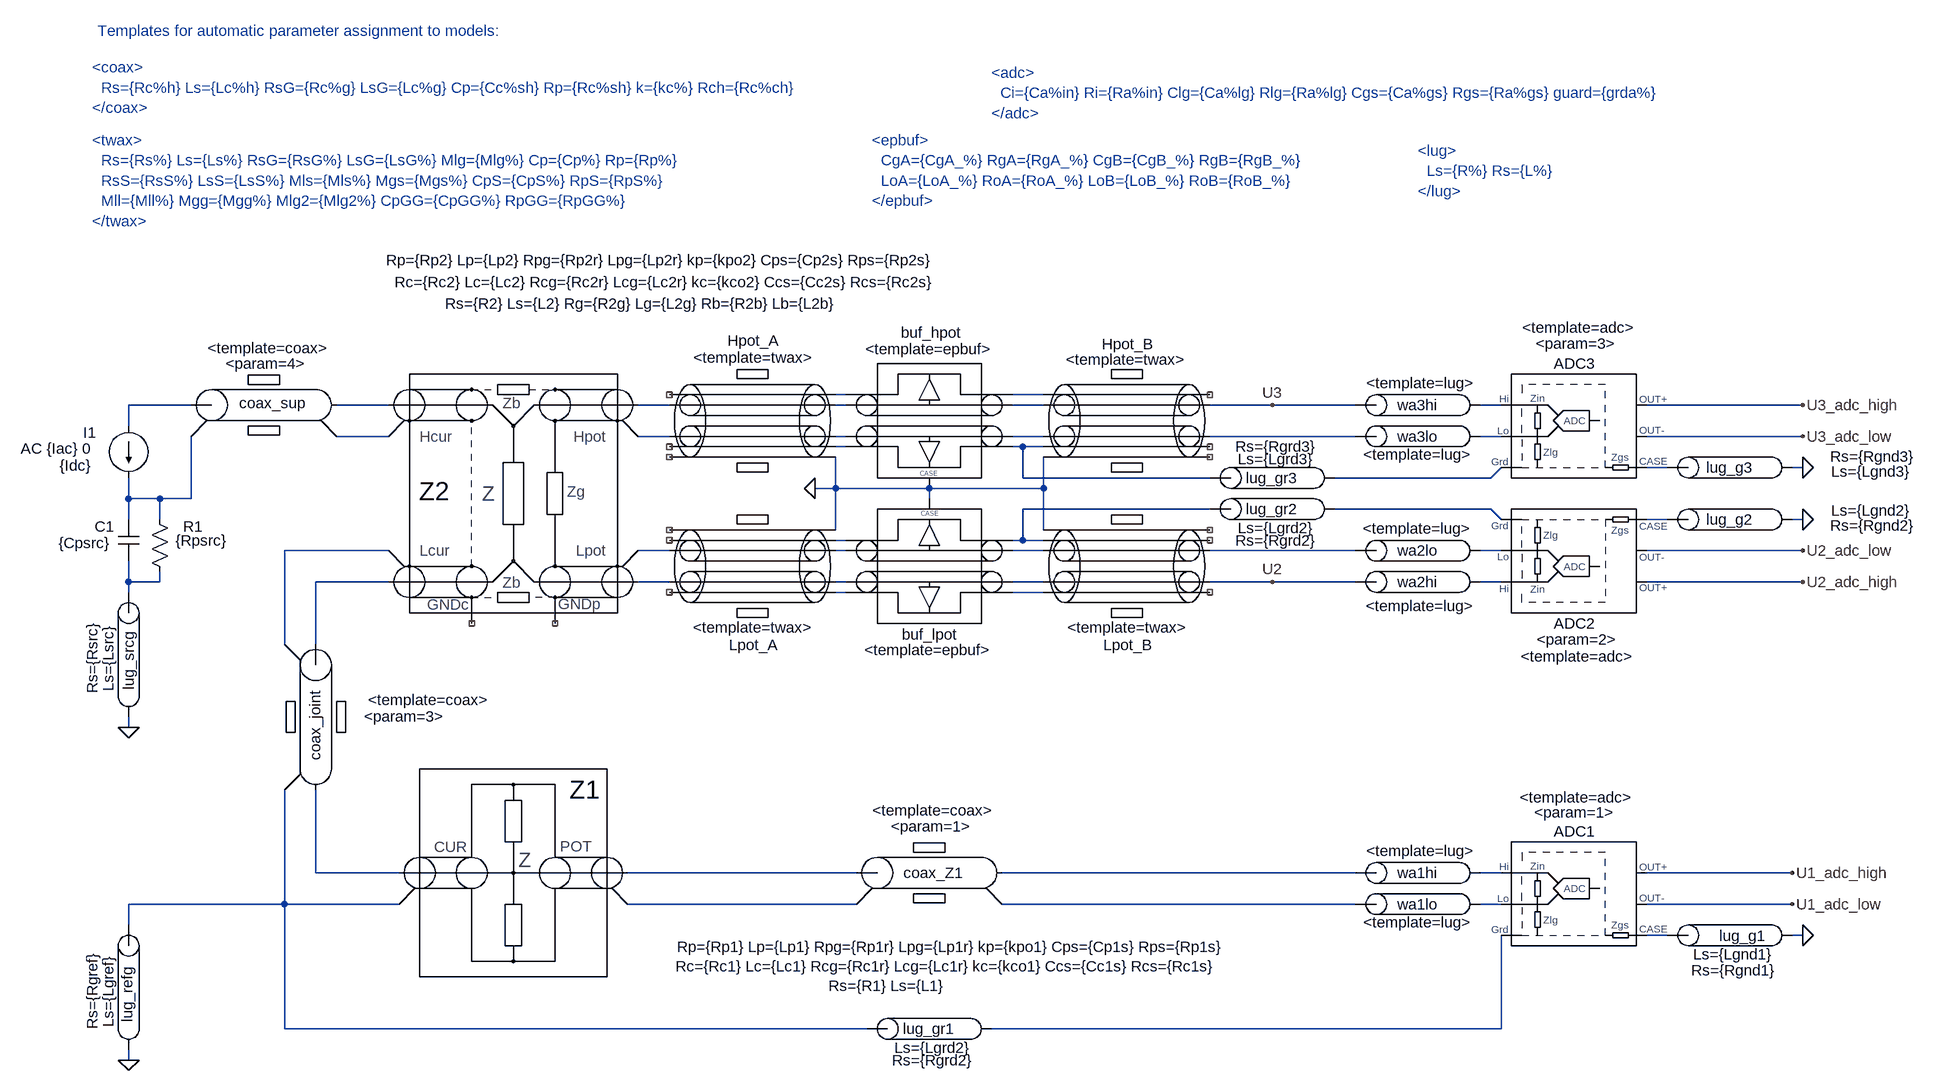
[diagram p0: schematic LiB_brg_4TP_twax.asc]
LiB_brg_4TP_twax.asc, the LTspice schematic file:
Version 4
SHEET 1 4400 2632
WIRE 208 -1872 192 -1872
WIRE 512 -1872 464 -1872
WIRE -800 -1856 -896 -1856
WIRE -496 -1856 -576 -1856
WIRE -64 -1856 -112 -1856
WIRE 208 -1856 192 -1856
WIRE 512 -1856 464 -1856
WIRE 864 -1856 768 -1856
WIRE 992 -1856 864 -1856
WIRE 1216 -1856 1184 -1856
WIRE 1680 -1856 1440 -1856
WIRE -896 -1824 -896 -1856
WIRE -496 -1808 -576 -1808
WIRE -64 -1808 -112 -1808
WIRE 208 -1808 192 -1808
WIRE 512 -1808 464 -1808
WIRE 992 -1808 768 -1808
WIRE 1216 -1808 1184 -1808
WIRE 1680 -1808 1440 -1808
WIRE 208 -1792 192 -1792
WIRE 480 -1792 464 -1792
WIRE 512 -1792 480 -1792
WIRE 1472 -1760 1440 -1760
WIRE 1680 -1760 1664 -1760
WIRE 480 -1744 480 -1792
WIRE 768 -1744 480 -1744
WIRE 1200 -1744 1216 -1760
WIRE 1200 -1744 960 -1744
WIRE 192 -1728 192 -1776
WIRE 192 -1728 160 -1728
WIRE 336 -1728 192 -1728
WIRE 512 -1728 512 -1776
WIRE 512 -1728 336 -1728
WIRE -896 -1712 -896 -1744
WIRE -848 -1712 -896 -1712
WIRE -800 -1712 -800 -1808
WIRE -800 -1712 -848 -1712
WIRE 336 -1712 336 -1728
WIRE 768 -1696 480 -1696
WIRE 1200 -1696 960 -1696
WIRE -896 -1680 -896 -1712
WIRE -848 -1680 -848 -1712
WIRE 1216 -1680 1200 -1696
WIRE 1472 -1680 1440 -1680
WIRE 1680 -1680 1664 -1680
WIRE 192 -1664 192 -1728
WIRE 512 -1664 512 -1728
WIRE 208 -1648 192 -1648
WIRE 480 -1648 480 -1696
WIRE 480 -1648 464 -1648
WIRE 512 -1648 480 -1648
WIRE -496 -1632 -656 -1632
WIRE -64 -1632 -112 -1632
WIRE 208 -1632 192 -1632
WIRE 512 -1632 464 -1632
WIRE 992 -1632 768 -1632
WIRE 1216 -1632 1184 -1632
WIRE 1680 -1632 1440 -1632
WIRE -896 -1584 -896 -1616
WIRE -848 -1584 -848 -1600
WIRE -848 -1584 -896 -1584
WIRE -496 -1584 -608 -1584
WIRE -64 -1584 -112 -1584
WIRE 208 -1584 192 -1584
WIRE 512 -1584 464 -1584
WIRE 864 -1584 768 -1584
WIRE 992 -1584 864 -1584
WIRE 1216 -1584 1184 -1584
WIRE 1680 -1584 1440 -1584
WIRE -896 -1568 -896 -1584
WIRE 208 -1568 192 -1568
WIRE 512 -1568 464 -1568
WIRE -656 -1488 -656 -1632
WIRE -608 -1488 -608 -1584
WIRE -896 -1360 -896 -1376
WIRE -608 -1136 -608 -1264
WIRE -480 -1136 -608 -1136
WIRE 224 -1136 -128 -1136
WIRE 992 -1136 448 -1136
WIRE 1216 -1136 1184 -1136
WIRE 1664 -1136 1440 -1136
WIRE -656 -1088 -656 -1264
WIRE -656 -1088 -896 -1088
WIRE -480 -1088 -656 -1088
WIRE 224 -1088 -128 -1088
WIRE 992 -1088 448 -1088
WIRE 1216 -1088 1184 -1088
WIRE 1664 -1088 1440 -1088
WIRE -896 -1056 -896 -1088
WIRE 1472 -1040 1440 -1040
WIRE 1680 -1040 1664 -1040
WIRE -656 -896 -656 -1088
WIRE 240 -896 -656 -896
WIRE 1216 -896 1216 -1040
WIRE 1216 -896 432 -896
WIRE -896 -848 -896 -864
FLAG 1680 -1040 0
FLAG -896 -1360 0
FLAG 1664 -1088 U1_adc_low
FLAG 1664 -1136 U1_adc_high
FLAG 1680 -1632 U2_adc_low
FLAG 1680 -1760 0
FLAG 1680 -1856 U3_adc_high
FLAG 1680 -1584 U2_adc_high
FLAG 1680 -1680 0
FLAG 160 -1728 0
FLAG 1680 -1808 U3_adc_low
FLAG 864 -1584 U2
FLAG 864 -1856 U3
FLAG -896 -848 0
SYMBOL std_coax_2P -400 -1088 R0
WINDOW 0 206 -176 Center 4
WINDOW 3 778 66 Center 2
WINDOW 123 765 96 Center 2
WINDOW 39 671 126 Center 2
SYMATTR InstName Z1
SYMATTR Value Rp={Rp1} Lp={Lp1} Rpg={Rp1r} Lpg={Lp1r} kp={kpo1} Cps={Cp1s} Rps={Rp1s}
SYMATTR Value2 Rc={Rc1} Lc={Lc1} Rcg={Rc1r} Lcg={Lc1r} kc={kco1} Ccs={Cc1s} Rcs={Rc1s}
SYMATTR SpiceLine Rs={R1} Ls={L1}
SYMBOL coax_cable -608 -1376 R90
WINDOW 0 13 1 Center 2
WINDOW 3 -26 -174 VCenter 2
WINDOW 123 -1 -137 VCenter 2
WINDOW 39 9 -199 Invisible 2
WINDOW 40 -19 -213 Invisible 2
SYMATTR InstName coax_joint
SYMATTR Value <template=coax>
SYMATTR Value2 <param=3>
SYMATTR SpiceLine ""
SYMATTR SpiceLine2 ""
SYMBOL coax_cable -688 -1856 R0
WINDOW 0 14 -3 Center 2
WINDOW 3 7 -88 Center 2
WINDOW 123 4 -64 Center 2
WINDOW 39 3 -65 Invisible 2
WINDOW 40 3 -92 Invisible 2
SYMATTR InstName coax_sup
SYMATTR Value <template=coax>
SYMATTR Value2 <param=4>
SYMATTR SpiceLine ""
SYMATTR SpiceLine2 ""
SYMBOL current -896 -1824 R0
WINDOW 0 -70 10 Left 2
WINDOW 3 -106 61 Left 2
WINDOW 123 -166 35 Left 2
SYMATTR InstName I1
SYMATTR Value {Idc}
SYMATTR Value2 AC {Iac} 0
SYMBOL coax_cable 336 -1136 R0
WINDOW 0 7 0 Center 2
WINDOW 3 6 -96 Center 2
WINDOW 123 4 -72 Center 2
WINDOW 39 3 -65 Invisible 2
WINDOW 40 3 -92 Invisible 2
SYMATTR InstName coax_Z1
SYMATTR Value <template=coax>
SYMATTR Value2 <param=1>
SYMATTR SpiceLine ""
SYMATTR SpiceLine2 ""
SYMBOL ground_lug 864 -1744 M180
SYMATTR InstName lug_gr3
SYMATTR Value Rs={Rgrd3}
SYMATTR Value2 Ls={Lgrd3}
SYMBOL ground_lug 1568 -1040 R0
WINDOW 0 -16 1 Left 2
WINDOW 3 6 54 Center 2
SYMATTR InstName lug_g1
SYMATTR Value Rs={Rgnd1}
SYMATTR Value2 Ls={Lgnd1}
SYMBOL ground_lug -896 -1472 R90
WINDOW 3 5 56 Center 2
WINDOW 123 6 31 Center 2
WINDOW 0 9 0 Center 2
SYMATTR Value Rs={Rsrc}
SYMATTR Value2 Ls={Lsrc}
SYMATTR InstName lug_srcg
SYMBOL std_4TP2 -208 -1808 M0
WINDOW 0 217 85 Center 4
WINDOW 3 -138 -271 Center 2
WINDOW 123 -141 -237 Center 2
WINDOW 39 -107 -204 Center 2
SYMATTR InstName Z2
SYMATTR Value Rp={Rp2} Lp={Lp2} Rpg={Rp2r} Lpg={Lp2r} kp={kpo2} Cps={Cp2s} Rps={Rp2s}
SYMATTR Value2 Rc={Rc2} Lc={Lc2} Rcg={Rc2r} Lcg={Lc2r} kc={kco2} Ccs={Cc2s} Rcs={Rc2s}
SYMATTR SpiceLine Rs={R2} Ls={L2} Rg={R2g} Lg={L2g} Rb={R2b} Lb={L2b}
SYMBOL ground_lug 1568 -1760 M180
WINDOW 3 220 17 Center 2
WINDOW 123 218 -6 Center 2
SYMATTR Value Rs={Rgnd3}
SYMATTR Value2 Ls={Lgnd3}
SYMATTR InstName lug_g3
SYMBOL ground_lug 864 -1696 R0
SYMATTR InstName lug_gr2
SYMATTR Value Rs={Rgrd2}
SYMATTR Value2 Ls={Lgrd2}
SYMBOL ground_lug 1568 -1680 R0
WINDOW 3 220 9 Center 2
WINDOW 123 218 -14 Center 2
SYMATTR Value Rs={Rgnd2}
SYMATTR Value2 Ls={Lgnd2}
SYMATTR InstName lug_g2
SYMBOL twax_cable 64 -1856 R180
WINDOW 0 -2 99 Center 2
WINDOW 3 -2 73 Center 2
WINDOW 123 2 91 Invisible 2
WINDOW 39 0 114 Invisible 2
SYMATTR InstName Hpot_A
SYMATTR Value <template=twax>
SYMATTR Value2 ""
SYMATTR SpiceLine ""
SYMBOL twax_cable 64 -1584 R0
WINDOW 0 2 97 Center 2
WINDOW 123 2 91 Invisible 2
WINDOW 39 0 114 Invisible 2
SYMATTR InstName Lpot_A
SYMATTR Value2 ""
SYMATTR SpiceLine ""
SYMATTR Value <template=twax>
SYMBOL dual_epbuf 336 -1808 R0
WINDOW 3 0 -134 Center 2
WINDOW 0 4 -160 Center 2
WINDOW 123 -5 -188 Invisible 2
WINDOW 39 -5 -167 Invisible 2
WINDOW 40 -5 -147 Invisible 2
SYMATTR Value <template=epbuf>
SYMATTR InstName buf_hpot
SYMATTR Value2 ""
SYMATTR SpiceLine ""
SYMATTR SpiceLine2 ""
SYMBOL dual_epbuf 336 -1632 R180
WINDOW 0 -1 -129 Center 2
WINDOW 3 1 -153 Center 2
WINDOW 123 -5 -188 Invisible 2
WINDOW 39 -5 -167 Invisible 2
WINDOW 40 -5 -147 Invisible 2
SYMATTR InstName buf_lpot
SYMATTR Value <template=epbuf>
SYMATTR Value2 ""
SYMATTR SpiceLine ""
SYMATTR SpiceLine2 ""
SYMBOL twax_cable 640 -1856 R180
WINDOW 39 0 115 Invisible 2
WINDOW 0 -2 94 Center 2
WINDOW 123 2 91 Invisible 2
SYMATTR SpiceLine ""
SYMATTR InstName Hpot_B
SYMATTR Value2 ""
SYMATTR Value <template=twax>
SYMBOL twax_cable 640 -1584 R0
WINDOW 0 2 97 Center 2
WINDOW 123 2 91 Invisible 2
WINDOW 39 0 114 Invisible 2
SYMATTR InstName Lpot_B
SYMATTR Value2 ""
SYMATTR SpiceLine ""
SYMATTR Value <template=twax>
SYMBOL digitizer_3458 1344 -1808 R0
WINDOW 3 -8 -167 Center 2
WINDOW 123 -12 -143 Center 2
WINDOW 39 -14 -141 Invisible 2
SYMATTR Value <template=adc>
SYMATTR Value2 <param=3>
SYMATTR SpiceLine ""
SYMATTR InstName ADC3
SYMBOL digitizer_3458 1344 -1632 M180
WINDOW 3 -10 -163 Center 2
WINDOW 123 -10 -137 Center 2
WINDOW 39 -14 -141 Invisible 2
SYMATTR Value <template=adc>
SYMATTR Value2 <param=2>
SYMATTR SpiceLine ""
SYMATTR InstName ADC2
SYMBOL digitizer_3458 1344 -1088 R0
WINDOW 3 -12 -164 Center 2
WINDOW 123 -14 -141 Center 2
WINDOW 39 -14 -141 Invisible 2
SYMATTR Value <template=adc>
SYMATTR Value2 <param=1>
SYMATTR SpiceLine ""
SYMATTR InstName ADC1
SYMBOL ground_lug 336 -896 R0
SYMATTR InstName lug_gr1
SYMATTR Value Rs={Rgrd2}
SYMATTR Value2 Ls={Lgrd2}
SYMBOL cap -912 -1680 R0
WINDOW 0 -36 11 Left 2
WINDOW 3 -92 36 Left 2
SYMATTR InstName C1
SYMATTR Value {Cpsrc}
SYMBOL res -864 -1696 R0
WINDOW 0 52 27 Left 2
WINDOW 3 40 48 Left 2
SYMATTR InstName R1
SYMATTR Value {Rpsrc}
SYMBOL ground_lug -896 -960 R90
WINDOW 3 5 56 Center 2
WINDOW 123 6 31 Center 2
WINDOW 0 10 2 Center 2
SYMATTR Value Rs={Rgref}
SYMATTR Value2 Ls={Lgref}
SYMATTR InstName lug_refg
SYMBOL ground_lug 1088 -1856 M180
WINDOW 3 5 34 Center 2
WINDOW 123 6 29 Invisible 2
SYMATTR Value <template=lug>
SYMATTR Value2 ""
SYMATTR InstName wa3hi
SYMBOL ground_lug 1088 -1808 M180
WINDOW 3 0 -28 Center 2
WINDOW 123 6 29 Invisible 2
SYMATTR Value <template=lug>
SYMATTR Value2 ""
SYMATTR InstName wa3lo
SYMBOL ground_lug 1088 -1584 M180
WINDOW 3 4 -37 Center 2
WINDOW 123 6 29 Invisible 2
SYMATTR Value <template=lug>
SYMATTR Value2 ""
SYMATTR InstName wa2hi
SYMBOL ground_lug 1088 -1632 M180
WINDOW 3 -1 34 Center 2
WINDOW 123 6 29 Invisible 2
SYMATTR Value <template=lug>
SYMATTR Value2 ""
SYMATTR InstName wa2lo
SYMBOL ground_lug 1088 -1136 M180
WINDOW 3 5 34 Center 2
WINDOW 123 6 29 Invisible 2
SYMATTR Value <template=lug>
SYMATTR Value2 ""
SYMATTR InstName wa1hi
SYMBOL ground_lug 1088 -1088 M180
WINDOW 3 0 -28 Center 2
WINDOW 123 6 29 Invisible 2
SYMATTR Value <template=lug>
SYMATTR Value2 ""
SYMATTR InstName wa1lo
TEXT -952 -2264 Left 2 ;<twax>\n  Rs={Rs%} Ls={Ls%} RsG={RsG%} LsG={LsG%} Mlg={Mlg%} Cp={Cp%} Rp={Rp%}\n  RsS={RsS%} LsS={LsS%} Mls={Mls%} Mgs={Mgs%} CpS={CpS%} RpS={RpS%}\n  Mll={Mll%} Mgg={Mgg%} Mlg2={Mlg2%} CpGG={CpGG%} RpGG={RpGG%}\n</twax>
TEXT 248 -2264 Left 2 ;<epbuf>\n  CgA={CgA_%} RgA={RgA_%} CgB={CgB_%} RgB={RgB_%}\n  LoA={LoA_%} RoA={RoA_%} LoB={LoB_%} RoB={RoB_%}\n</epbuf>
TEXT -952 -2376 Left 2 ;<coax>\n  Rs={Rc%h} Ls={Lc%h} RsG={Rc%g} LsG={Lc%g} Cp={Cc%sh} Rp={Rc%sh} k={kc%} Rch={Rc%ch}\n</coax>
TEXT 432 -2368 Left 2 ;<adc>\n  Ci={Ca%in} Ri={Ra%in} Clg={Ca%lg} Rlg={Ra%lg} Cgs={Ca%gs} Rgs={Ra%gs} guard={grda%}\n</adc>
TEXT 1088 -2248 Left 2 ;<lug>\n  Ls={R%} Rs={L%}\n</lug>
TEXT -944 -2432 Left 2 ;Templates for automatic parameter assignment to models:

The netlist it stands for:
* LiB_brg_4TP_twax.asc
XZ1 N038 N042 N039 N043 STDCOAX Rp={Rp1} Lp={Lp1} Rpg={Rp1r} Lpg={Lp1r} kp={kpo1} Cps={Cp1s} Rps={Rp1s} Rc={Rc1} Lc={Lc1} Rcg={Rc1r} Lcg={Lc1r} kc={kco1} Ccs={Cc1s} Rcs={Rc1s} Rs={R1} Ls={L1}  ; pins Ch Cl Ph PhG
Xcoax_joint N031 N038 N024 N042 COAXCAB <template=coax> <param=3>  ; pins LA LB RA RB
Xcoax_sup N003 N004 N019 N009 COAXCAB <template=coax> <param=4>  ; pins LA LB RA RB
I1 N003 N019 {Idc} AC {Iac} 0
Xcoax_Z1 N039 N040 N043 N044 COAXCAB <template=coax> <param=1>  ; pins LA LB RA RB
Xlug_gr3 N016 N018 GNDLUG Rs={Rgrd3} Ls={Lgrd3}  ; pins LA LB
Xlug_g1 N046 0 GNDLUG Rs={Rgnd1} Ls={Lgnd1}  ; pins LA LB
Xlug_srcg N030 0 GNDLUG Rs={Rsrc} Ls={Lsrc}  ; pins LA LB
XZ2 N005 N010 N032 N025 N004 N009 N031 N024 NC_01 NC_02 STD4TP3 Rp={Rp2} Lp={Lp2} Rpg={Rp2r} Lpg={Lp2r} kp={kpo2} Cps={Cp2s} Rps={Rp2s} Rc={Rc2} Lc={Lc2} Rcg={Rc2r} Lcg={Lc2r} kc={kco2} Ccs={Cc2s} Rcs={Rc2s} Rs={R2} Ls={L2} Rg={R2g} Lg={L2g} Rb={R2b} Lb={L2b}  ; pins Hp HpG Lp LpG Hc HcG Lc LcG Gpot Gcur
Xlug_g3 N017 0 GNDLUG Rs={Rgnd3} Ls={Lgnd3}  ; pins LA LB
Xlug_gr2 N020 N021 GNDLUG Rs={Rgrd2} Ls={Lgrd2}  ; pins LA LB
Xlug_g2 N022 0 GNDLUG Rs={Rgnd2} Ls={Lgnd2}  ; pins LA LB
XHpot_A N011 N015 N006 N001 0 N010 NC_03 N005 NC_04 NC_05 TWAXSH <template=twax>  ; pins AL1 AG1 BL1 BG1 SH1 BL1 BG1 BL2 BG2 SH1
XLpot_A N025 NC_06 N032 NC_07 NC_08 N026 N023 N033 N036 0 TWAXSH <template=twax>  ; pins AL1 AG1 BL1 BG1 SH1 BL1 BG1 BL2 BG2 SH1
Xbuf_hpot N006 N001 N011 N015 N007 N002 N012 N016 0 DUAL_EPBUF <template=epbuf>  ; pins AL1 AG1 BL1 BG1 BL1 BG1 BL2 BG2 CASE
Xbuf_lpot N034 N037 N027 N020 N033 N036 N026 N023 0 DUAL_EPBUF <template=epbuf>  ; pins AL1 AG1 BL1 BG1 BL1 BG1 BL2 BG2 CASE
XHpot_B N013 NC_09 U3 NC_10 NC_11 N012 N016 N007 N002 0 TWAXSH <template=twax>  ; pins AL1 AG1 BL1 BG1 SH1 BL1 BG1 BL2 BG2 SH1
XLpot_B N027 N020 N034 N037 0 N028 NC_12 U2 NC_13 NC_14 TWAXSH <template=twax>  ; pins AL1 AG1 BL1 BG1 SH1 BL1 BG1 BL2 BG2 SH1
XADC3 N008 N014 N018 N017 U3_adc_high U3_adc_low DIG3458 <template=adc> <param=3>  ; pins HI LO GRD CASE OUTP OUTN
XADC2 N035 N029 N021 N022 U2_adc_high U2_adc_low DIG3458 <template=adc> <param=2>  ; pins HI LO GRD CASE OUTP OUTN
XADC1 N041 N045 N047 N046 U1_adc_high U1_adc_low DIG3458 <template=adc> <param=1>  ; pins HI LO GRD CASE OUTP OUTN
Xlug_gr1 N042 N047 GNDLUG Rs={Rgrd2} Ls={Lgrd2}  ; pins LA LB
C1 N019 N030 {Cpsrc}
R1 N019 N030 {Rpsrc}
Xlug_refg N042 0 GNDLUG Rs={Rgref} Ls={Lgref}  ; pins LA LB
Xwa3hi U3 N008 GNDLUG <template=lug>  ; pins LA LB
Xwa3lo N013 N014 GNDLUG <template=lug>  ; pins LA LB
Xwa2hi U2 N035 GNDLUG <template=lug>  ; pins LA LB
Xwa2lo N028 N029 GNDLUG <template=lug>  ; pins LA LB
Xwa1hi N040 N041 GNDLUG <template=lug>  ; pins LA LB
Xwa1lo N044 N045 GNDLUG <template=lug>  ; pins LA LB
* <twax>
*   Rs={Rs%} Ls={Ls%} RsG={RsG%} LsG={LsG%} Mlg={Mlg%} Cp={Cp%} Rp={Rp%}
*   RsS={RsS%} LsS={LsS%} Mls={Mls%} Mgs={Mgs%} CpS={CpS%} RpS={RpS%}
*   Mll={Mll%} Mgg={Mgg%} Mlg2={Mlg2%} CpGG={CpGG%} RpGG={RpGG%}
* </twax>
* <epbuf>
*   CgA={CgA_%} RgA={RgA_%} CgB={CgB_%} RgB={RgB_%}
*   LoA={LoA_%} RoA={RoA_%} LoB={LoB_%} RoB={RoB_%}
* </epbuf>
* <coax>
*   Rs={Rc%h} Ls={Lc%h} RsG={Rc%g} LsG={Lc%g} Cp={Cc%sh} Rp={Rc%sh} k={kc%} Rch={Rc%ch}
* </coax>
* <adc>
*   Ci={Ca%in} Ri={Ra%in} Clg={Ca%lg} Rlg={Ra%lg} Cgs={Ca%gs} Rgs={Ra%gs} guard={grda%}
* </adc>
* <lug>
*   Ls={R%} Rs={L%}
* </lug>
* Templates for automatic parameter assignment to models:
.lib ZbrgLib.cir ZbrgLib
.backanno
.end